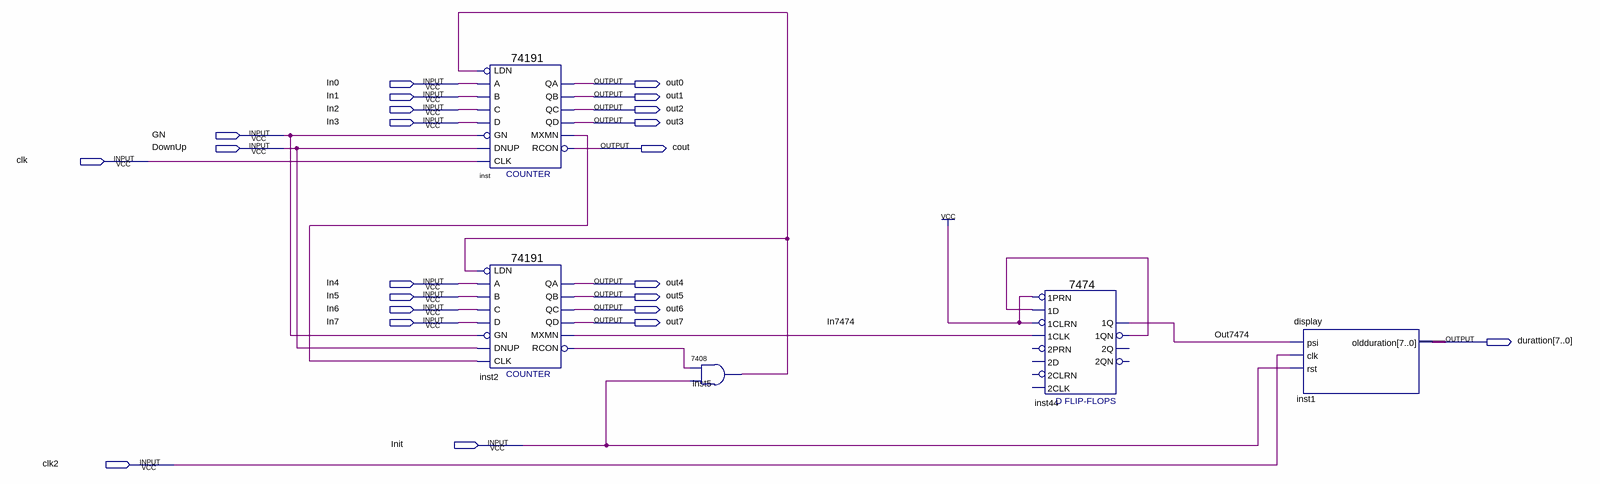
[diagram p0: schematic sheet]
// Quartus schematic counterDIv.bdf as structural Verilog: 5 symbols, 23 pins
module counterDIv (
  input  In0,
  input  In1,
  input  In2,
  input  In3,
  input  GN,
  input  DownUp,
  input  clk,
  input  In4,
  input  In5,
  input  In6,
  input  In7,
  input  Init,
  input  clk2,
  output out0,
  output out1,
  output out2,
  output out3,
  output cout,
  output out4,
  output out5,
  output out6,
  output out7,
  output [7:0] durattion
);

  wire In7474, inst2_rcon, inst5_1, inst44_1qn, inst_mxmn, Out7474;

  \74191  inst (
    .LDN(inst5_1), .D(In3), .C(In2), .B(In1), .A(In0), .CLK(clk), .DNUP(DownUp), .GN(GN), .RCON(cout),
    .MXMN(inst_mxmn), .QA(out0), .QB(out1), .QD(out3), .QC(out2));
  \74191  inst2 (
    .LDN(inst5_1), .D(In7), .C(In6), .B(In5), .A(In4), .CLK(inst_mxmn), .DNUP(DownUp), .GN(GN),
    .RCON(inst2_rcon), .MXMN(In7474), .QA(out4), .QB(out5), .QD(out7), .QC(out6));
  \7408  inst5 (.\3 (Init), .\2 (inst2_rcon), .\1 (inst5_1));
  \7474  inst44 (
    .\1CLK (In7474), .\1D (inst44_1qn), .\1PRN (1'b1), .\1CLRN (1'b1), .\1QN (inst44_1qn), .\1Q (Out7474));  // open: 2D, 2PRN, 2CLK, 2CLRN, 2Q, 2QN
  display inst1 (.psi(Out7474), .clk(clk2), .rst(Init), .oldduration(durattion));
endmodule
